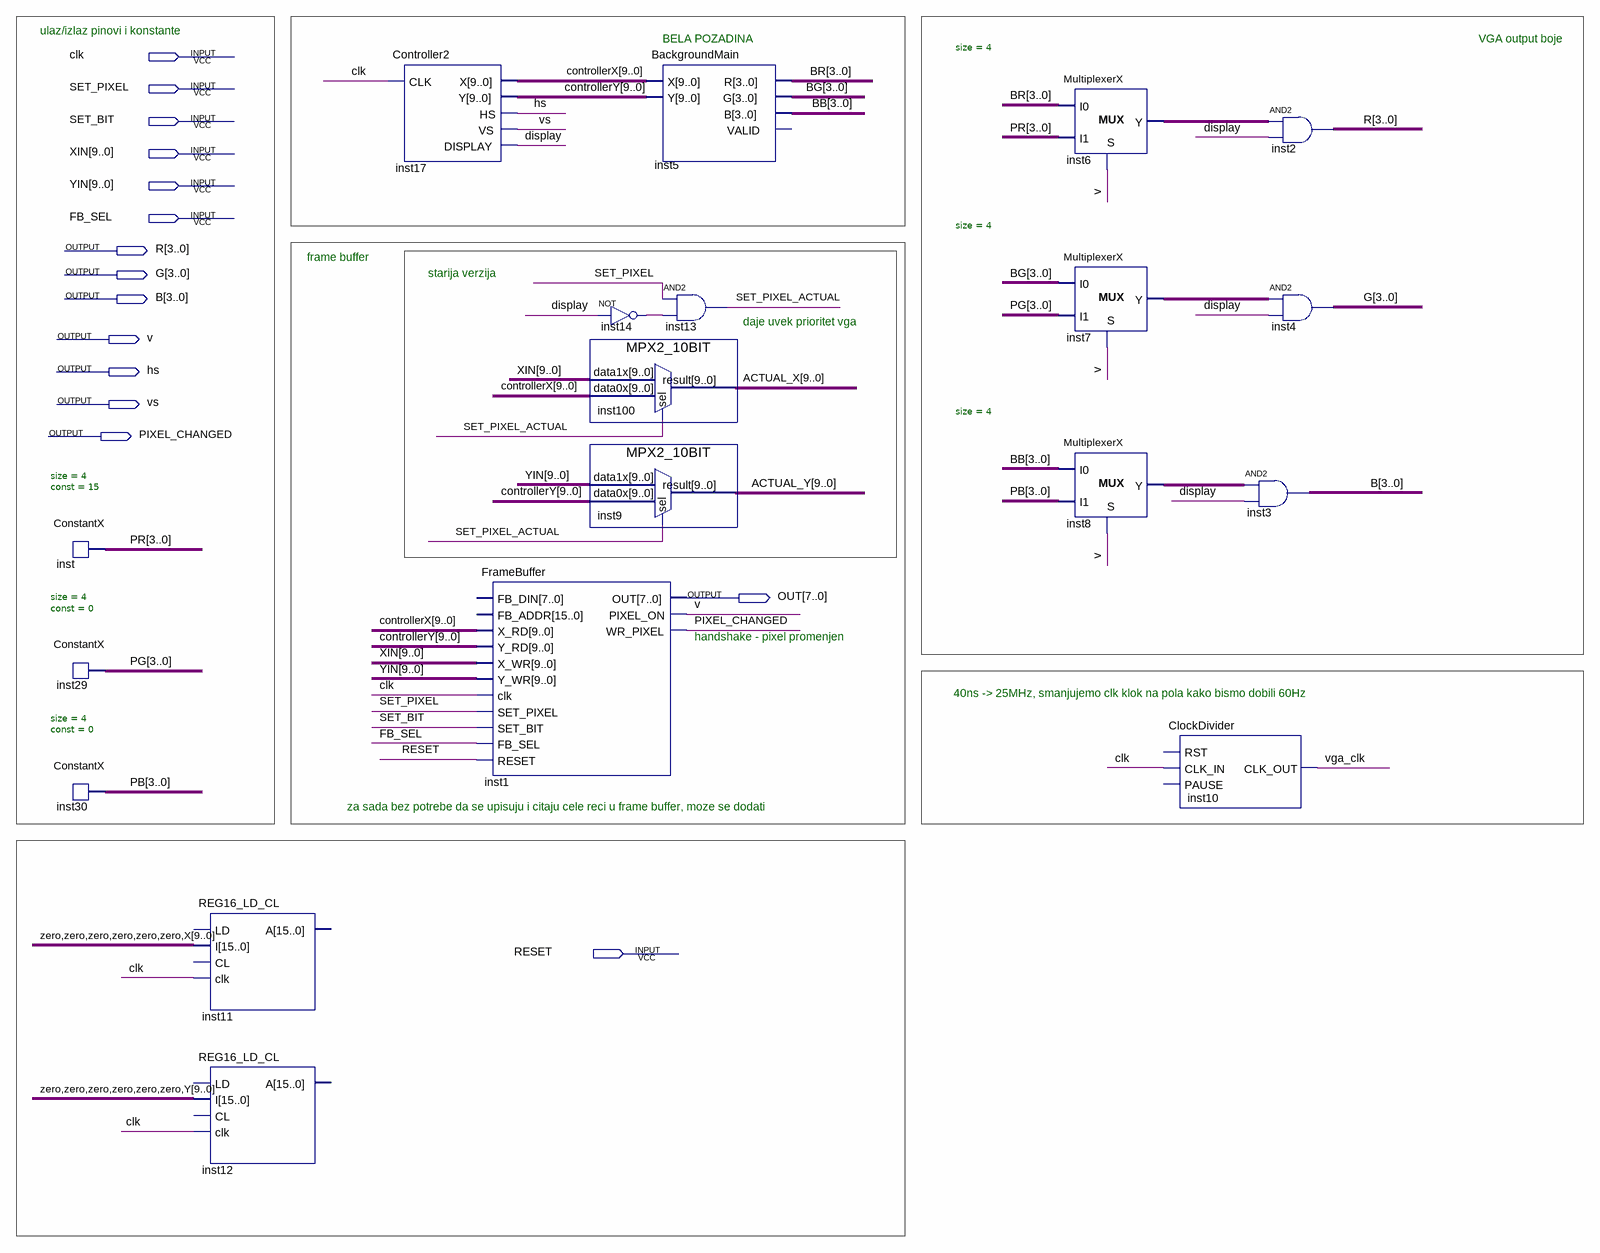
[diagram p0: schematic sheet]
// Quartus schematic Monitor.bdf as structural Verilog: 19 symbols, 15 pins
module Monitor (
  input  clk,
  input  SET_PIXEL,
  input  SET_BIT,
  input  [9:0] XIN,
  input  [9:0] YIN,
  input  FB_SEL,
  input  RESET,
  output [3:0] R,
  output [3:0] G,
  output [3:0] B,
  output v,
  output hs,
  output vs,
  output PIXEL_CHANGED,
  output [7:0] OUT
);

  wire display, inst14_out, SET_PIXEL_ACTUAL, vga_clk, zero;
  wire [3:0] BB, BG, BR, inst6_y, inst7_y, inst8_y, PB, PG, PR;
  wire [9:0] ACTUAL_X, ACTUAL_Y, controllerX, controllerY, X, Y;

  ConstantX #(.size(4), .\const (15)) inst (.DATA_OUT(PR));
  ConstantX #(.size(4), .\const (0)) inst29 (.DATA_OUT(PG));
  ConstantX #(.size(4), .\const (0)) inst30 (.DATA_OUT(PB));
  REG16_LD_CL inst11 (.I({{6{zero}}, X}), .clk(clk));  // open: LD, CL, A
  REG16_LD_CL inst12 (.I({{6{zero}}, Y}), .clk(clk));  // open: LD, CL, A
  Controller2 inst17 (.CLK(clk), .X(controllerX), .Y(controllerY), .HS(hs), .VS(vs), .DISPLAY(display));
  FrameBuffer inst1 (
    .X_RD(controllerX), .Y_RD(controllerY), .X_WR(XIN), .Y_WR(YIN), .clk(clk), .SET_PIXEL(SET_PIXEL),
    .SET_BIT(SET_BIT), .FB_SEL(FB_SEL), .RESET(RESET), .OUT(OUT), .PIXEL_ON(v), .WR_PIXEL(PIXEL_CHANGED));  // open: FB_DIN, FB_ADDR
  not inst14 (inst14_out, display);
  MPX2_10BIT inst100 (.data1x(XIN), .data0x(controllerX), .sel(SET_PIXEL_ACTUAL), .result(ACTUAL_X));
  MPX2_10BIT inst9 (.data1x(YIN), .data0x(controllerY), .sel(SET_PIXEL_ACTUAL), .result(ACTUAL_Y));
  BackgroundMain inst5 (.X(controllerX), .Y(controllerY), .R(BR), .G(BG), .B(BB));  // open: VALID
  and inst13 (SET_PIXEL_ACTUAL, SET_PIXEL, inst14_out);
  MultiplexerX #(.size(4)) inst6 (.S(v), .I0(BR), .I1(PR), .Y(inst6_y));
  MultiplexerX #(.size(4)) inst7 (.S(v), .I0(BG), .I1(PG), .Y(inst7_y));
  MultiplexerX #(.size(4)) inst8 (.S(v), .I0(BB), .I1(PB), .Y(inst8_y));
  ClockDivider inst10 (.CLK_IN(clk), .CLK_OUT(vga_clk));  // open: RST, PAUSE
  assign R = inst6_y & {4{display}};  // AND2 inst2, 4 bits wide
  assign G = inst7_y & {4{display}};  // AND2 inst4, 4 bits wide
  assign B = inst8_y & {4{display}};  // AND2 inst3, 4 bits wide

  // Notes on the sheet:
  //   ulaz/izlaz pinovi i konstante
  //   BELA POZADINA
  //   VGA output boje
  //   frame buffer
  //   starija verzija
  //   daje uvek prioritet vga
  //   handshake - pixel promenjen
  //   40ns -> 25MHz, smanjujemo clk klok na pola kako bismo dobili 60Hz 
  //   za sada bez potrebe da se upisuju i citaju cele reci u frame buffer, moze se dodati
endmodule
